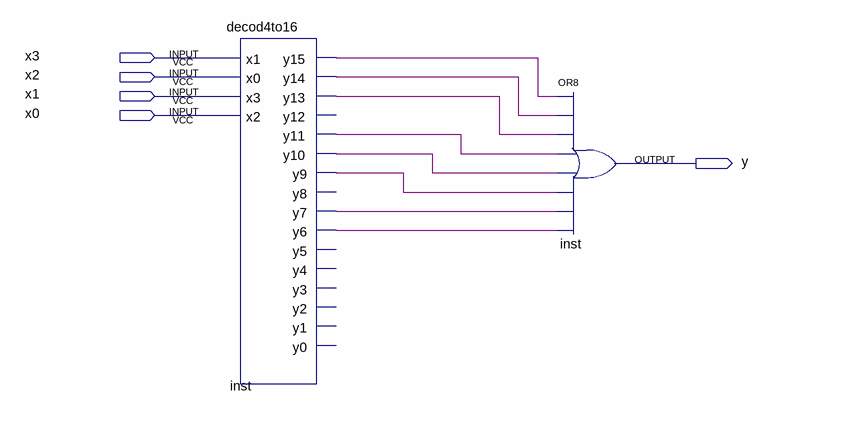
[diagram p0: schematic sheet]
// Quartus schematic Ex3.bdf as structural Verilog: 2 symbols, 5 pins
module Ex3 (
  input  x3,
  input  x2,
  input  x1,
  input  x0,
  output y
);

  wire inst_y6, inst_y7, inst_y9, inst_y10, inst_y11, inst_y13, inst_y14, inst_y15;

  decod4to16 inst (
    .x1(x3), .x0(x2), .x3(x1), .x2(x0), .y15(inst_y15), .y14(inst_y14), .y13(inst_y13), .y11(inst_y11),
    .y10(inst_y10), .y9(inst_y9), .y7(inst_y7), .y6(inst_y6));  // open: y12, y8, y5, y4, y3, y2, y1, y0
  or inst_dup2 (y, inst_y15, inst_y14, inst_y13, inst_y11, inst_y10, inst_y9, inst_y7, inst_y6);
endmodule
